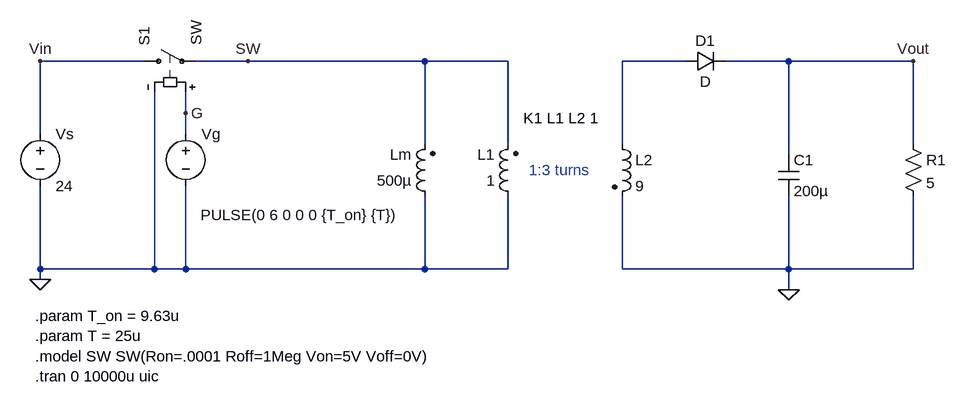
[diagram p0: schematic Flyback_converter.asc]
Flyback_converter.asc, the LTspice schematic file:
Version 4
SHEET 1 1384 680
WIRE 144 32 -16 32
WIRE 304 32 224 32
WIRE 576 32 304 32
WIRE 704 32 576 32
WIRE 976 32 880 32
WIRE 1136 32 1040 32
WIRE 1328 32 1136 32
WIRE 208 112 208 80
WIRE -16 144 -16 32
WIRE 208 144 208 112
WIRE 576 160 576 32
WIRE 704 160 704 32
WIRE 880 160 880 32
WIRE 1328 160 1328 32
WIRE 1136 176 1136 32
WIRE -16 352 -16 224
WIRE 160 352 160 80
WIRE 160 352 -16 352
WIRE 208 352 208 224
WIRE 208 352 160 352
WIRE 576 352 576 240
WIRE 576 352 208 352
WIRE 704 352 704 240
WIRE 704 352 576 352
WIRE 880 352 880 240
WIRE 1136 352 1136 240
WIRE 1136 352 880 352
WIRE 1328 352 1328 240
WIRE 1328 352 1136 352
WIRE -16 368 -16 352
WIRE 1136 384 1136 352
FLAG -16 368 0
FLAG -16 32 Vin
FLAG 304 32 SW
FLAG 1328 32 Vout
FLAG 208 112 G
FLAG 1136 384 0
SYMBOL voltage -16 128 R0
WINDOW 123 0 0 Left 2
WINDOW 39 0 0 Left 2
SYMATTR InstName Vs
SYMATTR Value 24
SYMBOL sw 128 32 R270
SYMATTR InstName S1
SYMBOL voltage 208 128 R0
WINDOW 3 23 141 Left 2
WINDOW 123 0 0 Left 2
WINDOW 39 0 0 Left 2
SYMATTR Value PULSE(0 6 0 0 0 {T_on} {T})
SYMATTR InstName Vg
SYMBOL ind2 592 256 R180
WINDOW 0 36 80 Left 2
WINDOW 3 36 40 Left 2
SYMATTR InstName Lm
SYMATTR Value 500µ
SYMATTR Type ind
SYMBOL ind2 720 256 R180
WINDOW 0 36 80 Left 2
WINDOW 3 36 40 Left 2
SYMATTR InstName L1
SYMATTR Value 1
SYMATTR Type ind
SYMBOL ind2 864 144 R0
SYMATTR InstName L2
SYMATTR Value 9
SYMATTR Type ind
SYMBOL diode 976 48 R270
WINDOW 0 32 32 VTop 2
WINDOW 3 0 32 VBottom 2
SYMATTR InstName D1
SYMBOL cap 1120 176 R0
SYMATTR InstName C1
SYMATTR Value 200µ
SYMBOL res 1312 144 R0
SYMATTR InstName R1
SYMATTR Value 5
TEXT -24 424 Left 2 !.param T_on = 9.63u\n.param T = 25u\n.model SW SW(Ron=.0001 Roff=1Meg Von=5V Voff=0V)\n.tran 0 10000u uic
TEXT 736 200 Left 2 ;1:3 turns
TEXT 728 120 Left 2 !K1 L1 L2 1

The netlist it stands for:
* Flyback_converter.asc
Vs Vin 0 24
S1 Vin SW G 0 SW
Vg G 0 PULSE(0 6 0 0 0 {T_on} {T})
Lm 0 SW 500µ
L1 0 SW 1
L2 N001 0 9
D1 N001 Vout D
C1 Vout 0 200µ
R1 Vout 0 5
.model D D
.lib standard.dio
.param T_on = 9.63u
.param T = 25u
.model SW SW(Ron=.0001 Roff=1Meg Von=5V Voff=0V)
.tran 0 10000u uic
* 1:3 turns
K1 L1 L2 1
.backanno
.end